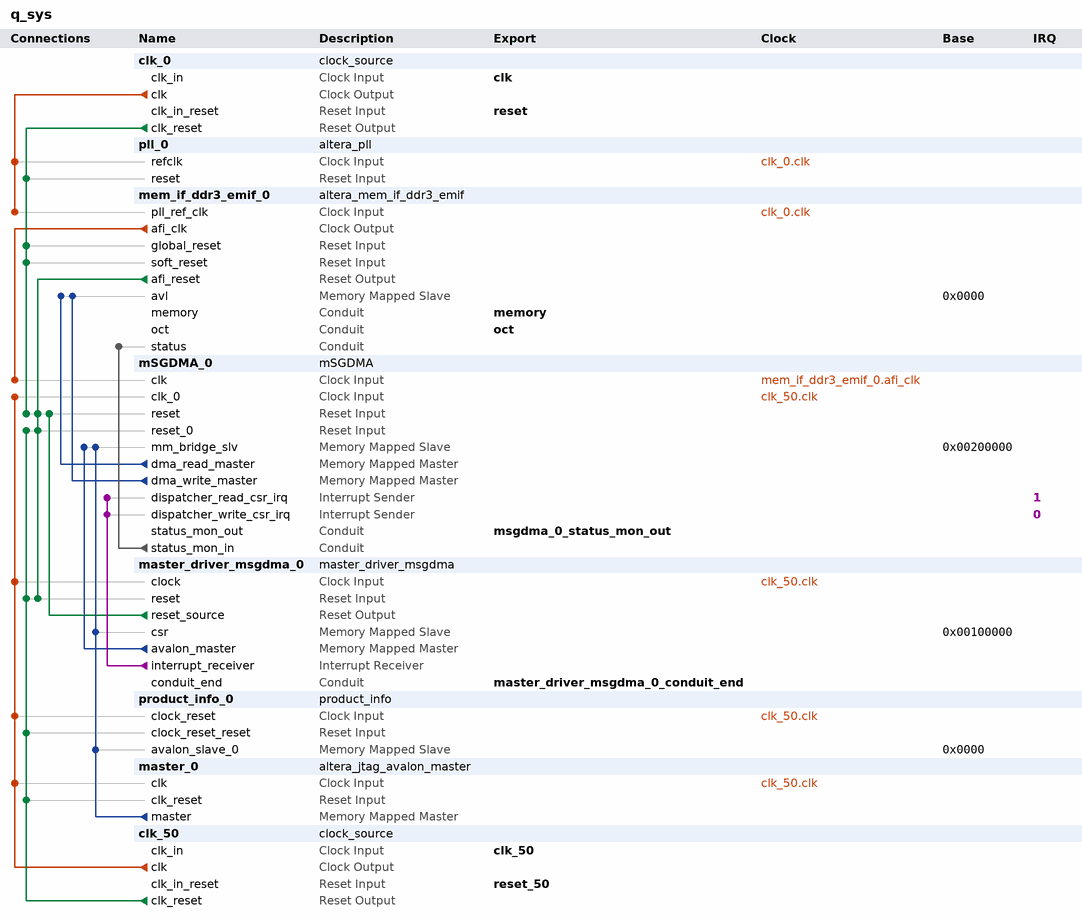
[diagram p0: system contents]
# Platform Designer (Qsys) system q_sys, Cyclone V 5CEFA7F31I7
# Parameters at their usual value, and those the tool derives, are not listed.
package require -exact qsys 12.1
create_system q_sys
set_project_property DEVICE_FAMILY {Cyclone V}
set_project_property DEVICE 5CEFA7F31I7

add_instance clk_0 clock_source 12.1
set_instance_parameter_value clk_0 clockFrequency 125000000

add_instance pll_0 altera_pll 12.1
set_instance_parameter_value pll_0 gui_device_speed_grade 7
set_instance_parameter_value pll_0 gui_pll_mode {Fractional-N PLL}
set_instance_parameter_value pll_0 gui_reference_clock_frequency 125.0
set_instance_parameter_value pll_0 gui_operation_mode direct
set_instance_parameter_value pll_0 gui_fractional_cout 24
set_instance_parameter_value pll_0 gui_use_locked false
set_instance_parameter_value pll_0 gui_number_of_clocks 1
set_instance_parameter_value pll_0 gui_output_clock_frequency0 150.0

add_instance mem_if_ddr3_emif_0 altera_mem_if_ddr3_emif 12.1
set_instance_parameter_value mem_if_ddr3_emif_0 MEM_VENDOR Micron
set_instance_parameter_value mem_if_ddr3_emif_0 MEM_FORMAT DISCRETE
set_instance_parameter_value mem_if_ddr3_emif_0 MEM_CLK_FREQ_MAX 800.0
set_instance_parameter_value mem_if_ddr3_emif_0 MEM_ROW_ADDR_WIDTH 14
set_instance_parameter_value mem_if_ddr3_emif_0 MEM_COL_ADDR_WIDTH 10
set_instance_parameter_value mem_if_ddr3_emif_0 MEM_DQ_WIDTH 32
set_instance_parameter_value mem_if_ddr3_emif_0 MEM_BANKADDR_WIDTH 3
set_instance_parameter_value mem_if_ddr3_emif_0 MEM_DRV_STR RZQ/6
set_instance_parameter_value mem_if_ddr3_emif_0 MEM_WTCL 6
set_instance_parameter_value mem_if_ddr3_emif_0 MEM_TCL 7
set_instance_parameter_value mem_if_ddr3_emif_0 TIMING_TIS 125
set_instance_parameter_value mem_if_ddr3_emif_0 TIMING_TIH 200
set_instance_parameter_value mem_if_ddr3_emif_0 TIMING_TDS 25
set_instance_parameter_value mem_if_ddr3_emif_0 TIMING_TDH 100
set_instance_parameter_value mem_if_ddr3_emif_0 TIMING_TDQSQ 150
set_instance_parameter_value mem_if_ddr3_emif_0 TIMING_TDQSCK 300
set_instance_parameter_value mem_if_ddr3_emif_0 TIMING_TDQSS 0.25
set_instance_parameter_value mem_if_ddr3_emif_0 TIMING_TQSH 0.38
set_instance_parameter_value mem_if_ddr3_emif_0 TIMING_TDSH 0.2
set_instance_parameter_value mem_if_ddr3_emif_0 TIMING_TDSS 0.2
set_instance_parameter_value mem_if_ddr3_emif_0 MEM_TRAS_NS 37.5
set_instance_parameter_value mem_if_ddr3_emif_0 MEM_TRCD_NS 13.125
set_instance_parameter_value mem_if_ddr3_emif_0 MEM_TRP_NS 13.125
set_instance_parameter_value mem_if_ddr3_emif_0 MEM_TRFC_NS 160.0
set_instance_parameter_value mem_if_ddr3_emif_0 MEM_TWTR 4
set_instance_parameter_value mem_if_ddr3_emif_0 MEM_TFAW_NS 37.5
set_instance_parameter_value mem_if_ddr3_emif_0 MEM_TRRD_NS 7.5
set_instance_parameter_value mem_if_ddr3_emif_0 MEM_TRTP_NS 7.5
set_instance_parameter_value mem_if_ddr3_emif_0 RATE Half
set_instance_parameter_value mem_if_ddr3_emif_0 MEM_CLK_FREQ 300.0
set_instance_parameter_value mem_if_ddr3_emif_0 SPEED_GRADE 7
set_instance_parameter_value mem_if_ddr3_emif_0 HARD_EMIF false
set_instance_parameter_value mem_if_ddr3_emif_0 POWER_OF_TWO_BUS true
set_instance_parameter_value mem_if_ddr3_emif_0 AVL_MAX_SIZE 4
set_instance_parameter_value mem_if_ddr3_emif_0 BYTE_ENABLE false
set_instance_parameter_value mem_if_ddr3_emif_0 CFG_REORDER_DATA false
set_instance_parameter_value mem_if_ddr3_emif_0 AVL_DATA_WIDTH_PORT 128,32,32,32,32,32
set_instance_parameter_value mem_if_ddr3_emif_0 PRIORITY_PORT 1,1,1,1,1,1
set_instance_parameter_value mem_if_ddr3_emif_0 CPORT_TYPE_PORT Bidirectional,Bidirectional,Bidirectional,Bidirectional,Bidirectional,Bidirectional
set_instance_parameter_value mem_if_ddr3_emif_0 REF_CLK_FREQ 125.0
set_instance_parameter_value mem_if_ddr3_emif_0 DEFAULT_FAST_SIM_MODEL true
set_instance_parameter_value mem_if_ddr3_emif_0 EXPORT_AFI_HALF_CLK false
set_instance_parameter_value mem_if_ddr3_emif_0 PLL_LOCATION Top_Bottom
set_instance_parameter_value mem_if_ddr3_emif_0 CALIBRATION_MODE Skip
set_instance_parameter_value mem_if_ddr3_emif_0 USER_DEBUG_LEVEL 1
set_instance_parameter_value mem_if_ddr3_emif_0 TIMING_BOARD_MAX_CK_DELAY 0.42
set_instance_parameter_value mem_if_ddr3_emif_0 TIMING_BOARD_MAX_DQS_DELAY 0.437
set_instance_parameter_value mem_if_ddr3_emif_0 TIMING_BOARD_SKEW_CKDQS_DIMM_MIN -0.0039
set_instance_parameter_value mem_if_ddr3_emif_0 TIMING_BOARD_SKEW_CKDQS_DIMM_MAX 0.012
set_instance_parameter_value mem_if_ddr3_emif_0 TIMING_BOARD_SKEW_WITHIN_DQS 0.011
set_instance_parameter_value mem_if_ddr3_emif_0 TIMING_BOARD_SKEW_BETWEEN_DQS 0.029
set_instance_parameter_value mem_if_ddr3_emif_0 TIMING_BOARD_DQ_TO_DQS_SKEW -0.0040
set_instance_parameter_value mem_if_ddr3_emif_0 TIMING_BOARD_AC_SKEW 0.0039
set_instance_parameter_value mem_if_ddr3_emif_0 TIMING_BOARD_AC_TO_CK_SKEW -0.0010

add_instance mSGDMA_0 mSGDMA 1.0

add_instance master_driver_msgdma_0 master_driver_msgdma 1.0
set_instance_parameter_value master_driver_msgdma_0 PRBS_PATTERN_GENERATOR_BASE 2097216
set_instance_parameter_value master_driver_msgdma_0 PRBS_PATTERN_CHECKER_BASE 2097152
set_instance_parameter_value master_driver_msgdma_0 MEMORY_BASE_ADDRESS 0
set_instance_parameter_value master_driver_msgdma_0 MEMORY_SPAN 536870912
set_instance_parameter_value master_driver_msgdma_0 BLOCK_SIZE 536870912
set_instance_parameter_value master_driver_msgdma_0 DISPATCHER_WRITE_CSR 2097248
set_instance_parameter_value master_driver_msgdma_0 DISPATCHER_WRITE_DESCRIPTOR 2097312
set_instance_parameter_value master_driver_msgdma_0 DISPATCHER_READ_CSR 2097280
set_instance_parameter_value master_driver_msgdma_0 DISPATCHER_READ_DESCRIPTOR 2097328
set_instance_parameter_value master_driver_msgdma_0 TIMER_BASE 2625536
set_instance_parameter_value master_driver_msgdma_0 FREQUENCY_COUNTER_BASE 2686976
set_instance_parameter_value master_driver_msgdma_0 ENABLE_PER_INFO 1
set_instance_parameter_value master_driver_msgdma_0 LOCAL_DATA_WORDS 16

add_instance product_info_0 product_info 1.0

add_instance master_0 altera_jtag_avalon_master 12.1

add_instance clk_50 clock_source 12.1
set_instance_parameter_value clk_50 clockFrequency 50000000

# connections
add_connection clk_0.clk mem_if_ddr3_emif_0.pll_ref_clk clock
add_connection clk_0.clk pll_0.refclk clock
add_connection clk_50.clk master_0.clk clock
add_connection clk_50.clk master_driver_msgdma_0.clock clock
add_connection clk_50.clk mSGDMA_0.clk_0 clock
add_connection clk_50.clk product_info_0.clock_reset clock
add_connection mem_if_ddr3_emif_0.afi_clk mSGDMA_0.clk clock
add_connection clk_0.clk_reset mem_if_ddr3_emif_0.global_reset reset
add_connection clk_0.clk_reset mem_if_ddr3_emif_0.soft_reset reset
add_connection clk_0.clk_reset mSGDMA_0.reset reset
add_connection clk_0.clk_reset pll_0.reset reset
add_connection clk_50.clk_reset master_0.clk_reset reset
add_connection clk_50.clk_reset master_driver_msgdma_0.reset reset
add_connection clk_50.clk_reset mSGDMA_0.reset_0 reset
add_connection clk_50.clk_reset product_info_0.clock_reset_reset reset
add_connection master_driver_msgdma_0.reset_source mSGDMA_0.reset reset
add_connection mem_if_ddr3_emif_0.afi_reset master_driver_msgdma_0.reset reset
add_connection mem_if_ddr3_emif_0.afi_reset mSGDMA_0.reset reset
add_connection mem_if_ddr3_emif_0.afi_reset mSGDMA_0.reset_0 reset
add_connection master_0.master master_driver_msgdma_0.csr avalon
set_connection_parameter_value master_0.master/master_driver_msgdma_0.csr baseAddress 0x00100000
add_connection master_0.master mSGDMA_0.mm_bridge_slv avalon
set_connection_parameter_value master_0.master/mSGDMA_0.mm_bridge_slv baseAddress 0x00200000
add_connection master_0.master product_info_0.avalon_slave_0 avalon
set_connection_parameter_value master_0.master/product_info_0.avalon_slave_0 baseAddress 0x0000
add_connection master_driver_msgdma_0.avalon_master mSGDMA_0.mm_bridge_slv avalon
set_connection_parameter_value master_driver_msgdma_0.avalon_master/mSGDMA_0.mm_bridge_slv baseAddress 0x00200000
add_connection mSGDMA_0.dma_read_master mem_if_ddr3_emif_0.avl avalon
set_connection_parameter_value mSGDMA_0.dma_read_master/mem_if_ddr3_emif_0.avl baseAddress 0x0000
add_connection mSGDMA_0.dma_write_master mem_if_ddr3_emif_0.avl avalon
set_connection_parameter_value mSGDMA_0.dma_write_master/mem_if_ddr3_emif_0.avl baseAddress 0x0000
add_connection mSGDMA_0.status_mon_in mem_if_ddr3_emif_0.status conduit
add_connection master_driver_msgdma_0.interrupt_receiver mSGDMA_0.dispatcher_read_csr_irq interrupt
set_connection_parameter_value master_driver_msgdma_0.interrupt_receiver/mSGDMA_0.dispatcher_read_csr_irq irqNumber 1
add_connection master_driver_msgdma_0.interrupt_receiver mSGDMA_0.dispatcher_write_csr_irq interrupt
set_connection_parameter_value master_driver_msgdma_0.interrupt_receiver/mSGDMA_0.dispatcher_write_csr_irq irqNumber 0

# exported interfaces
add_interface clk clock sink
set_interface_property clk EXPORT_OF clk_0.clk_in
add_interface reset reset sink
set_interface_property reset EXPORT_OF clk_0.clk_in_reset
add_interface memory conduit end
set_interface_property memory EXPORT_OF mem_if_ddr3_emif_0.memory
add_interface oct conduit end
set_interface_property oct EXPORT_OF mem_if_ddr3_emif_0.oct
add_interface clk_50 clock sink
set_interface_property clk_50 EXPORT_OF clk_50.clk_in
add_interface reset_50 reset sink
set_interface_property reset_50 EXPORT_OF clk_50.clk_in_reset
add_interface master_driver_msgdma_0_conduit_end conduit end
set_interface_property master_driver_msgdma_0_conduit_end EXPORT_OF master_driver_msgdma_0.conduit_end
add_interface msgdma_0_status_mon_out conduit end
set_interface_property msgdma_0_status_mon_out EXPORT_OF mSGDMA_0.status_mon_out

save_system q_sys.qsys
